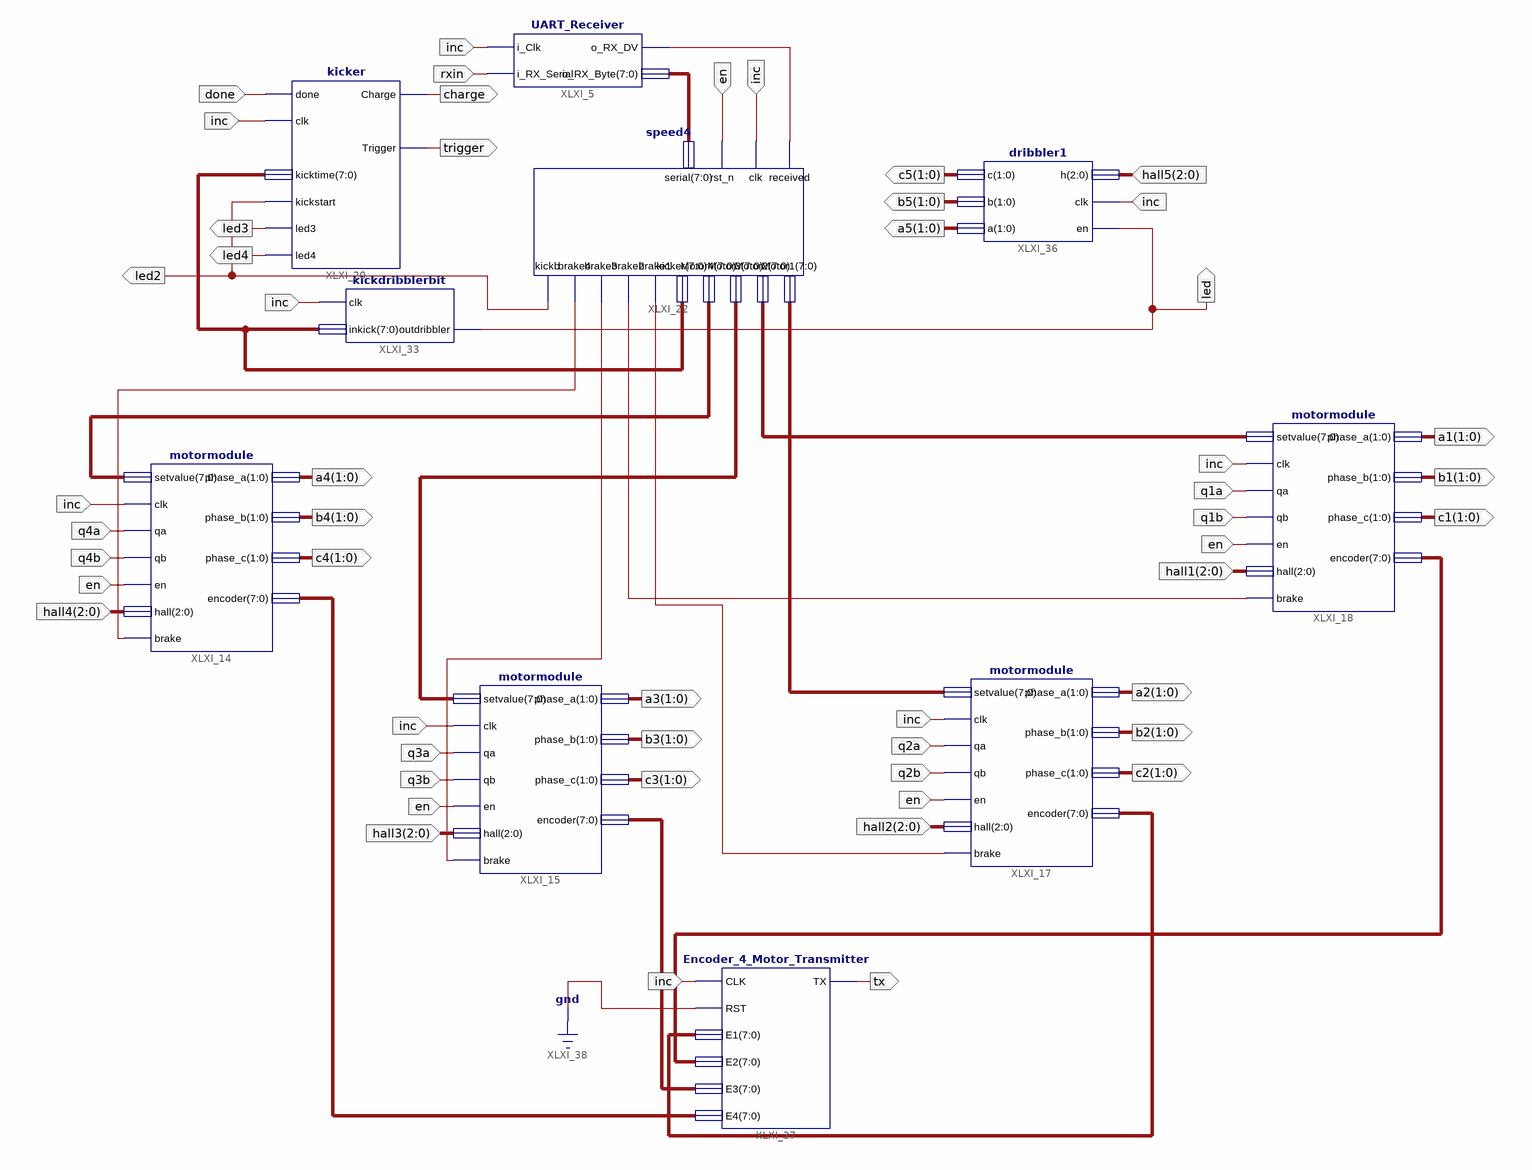
[diagram p0: schematic sheet 1]
// Xilinx ISE schematic motorpackage.sch (spartan6) as structural Verilog: 10 symbols, 39 ports
module motorpackage (
  input  inc,
  input  rxin,
  input  en,
  input  done,
  input  [2:0] hall5,
  input  q4a,
  input  q4b,
  input  [2:0] hall4,
  input  q1a,
  input  q1b,
  input  [2:0] hall1,
  input  q2a,
  input  q2b,
  input  [2:0] hall2,
  input  q3a,
  input  q3b,
  input  [2:0] hall3,
  output led,
  output [1:0] c5,
  output [1:0] b5,
  output [1:0] a5,
  output charge,
  output trigger,
  output [1:0] a4,
  output [1:0] b4,
  output [1:0] c4,
  output [1:0] a1,
  output [1:0] b1,
  output [1:0] c1,
  output [1:0] a2,
  output [1:0] b2,
  output [1:0] c2,
  output [1:0] a3,
  output [1:0] b3,
  output [1:0] c3,
  output led2,
  output led3,
  output led4,
  output tx
);

  wire XLXN_1, XLXN_128, XLXN_129, XLXN_130, XLXN_131;
  wire [7:0] XLXN_2, XLXN_86, XLXN_87, XLXN_88, XLXN_89, XLXN_127, XLXN_245, XLXN_246, XLXN_247, XLXN_248;

  UART_Receiver XLXI_5 (.i_Clk(inc), .i_RX_Serial(rxin), .o_RX_DV(XLXN_1), .o_RX_Byte(XLXN_2));
  kicker XLXI_20 (
    .done(done), .clk(inc), .kickstart(led2), .kicktime(XLXN_127), .Charge(charge), .Trigger(trigger),
    .led3(led3), .led4(led4));
  speed4 XLXI_22 (
    .received(XLXN_1), .clk(inc), .rst_n(en), .serial(XLXN_2), .brake1(XLXN_128), .brake2(XLXN_129),
    .brake3(XLXN_130), .brake4(XLXN_131), .Motor1(XLXN_86), .Motor2(XLXN_87), .Motor3(XLXN_88),
    .Motor4(XLXN_89), .kicker(XLXN_127), .kickb(led2));
  kickdribblerbit XLXI_33 (.clk(inc), .inkick(XLXN_127), .outdribbler(led));
  dribbler1 XLXI_36 (.en(led), .clk(inc), .h(hall5), .a(a5), .b(b5), .c(c5));
  motormodule XLXI_14 (
    .setvalue(XLXN_89), .clk(inc), .qa(q4a), .qb(q4b), .en(en), .hall(hall4), .phase_a(a4), .phase_b(b4),
    .phase_c(c4), .encoder(XLXN_248), .brake(XLXN_131));
  motormodule XLXI_18 (
    .setvalue(XLXN_87), .clk(inc), .qa(q1a), .qb(q1b), .en(en), .hall(hall1), .phase_a(a1), .phase_b(b1),
    .phase_c(c1), .encoder(XLXN_246), .brake(XLXN_129));
  motormodule XLXI_17 (
    .setvalue(XLXN_86), .clk(inc), .qa(q2a), .qb(q2b), .en(en), .hall(hall2), .phase_a(a2), .phase_b(b2),
    .phase_c(c2), .encoder(XLXN_245), .brake(XLXN_128));
  motormodule XLXI_15 (
    .setvalue(XLXN_88), .clk(inc), .qa(q3a), .qb(q3b), .en(en), .hall(hall3), .phase_a(a3), .phase_b(b3),
    .phase_c(c3), .encoder(XLXN_247), .brake(XLXN_130));
  Encoder_4_Motor_Transmitter XLXI_37 (
    .CLK(inc), .RST(1'b0), .E1(XLXN_245), .E2(XLXN_246), .E3(XLXN_247), .E4(XLXN_248), .TX(tx));
endmodule
